# Altium schematic sheet motordriver.SchDoc
size A4; SheetNumber: 4; SheetTotal: 5
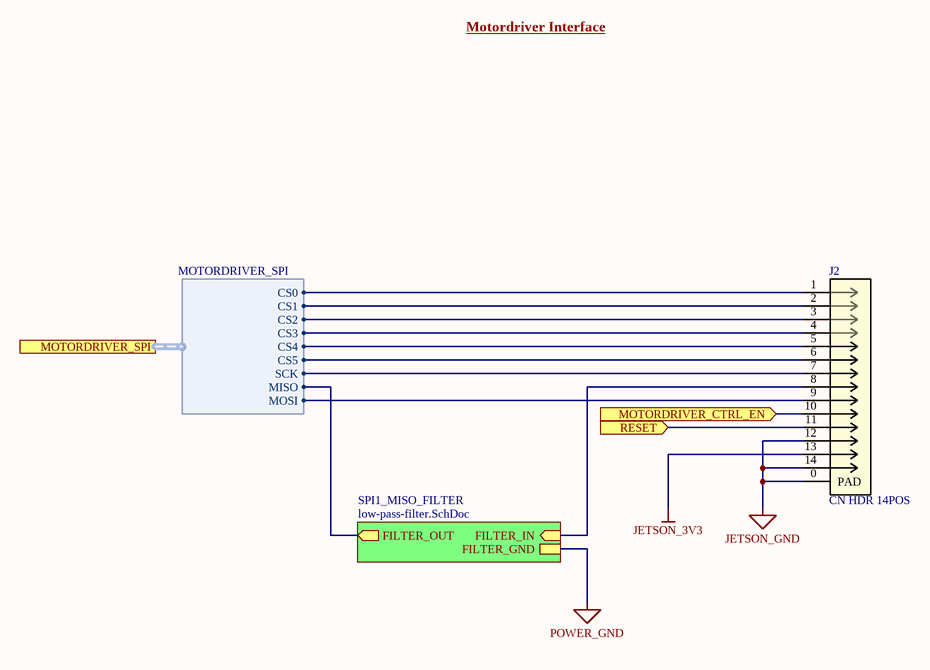
[diagram p0: motordriver.SchDoc]

## Parts
J2  CN HDR 14POS  [CN HDR 14POS SMD 1.5MM]

## Sub-sheets
SPI1_MISO_FILTER = low-pass-filter.SchDoc: FILTER_OUT (out), FILTER_IN (in), FILTER_GND

## Ports
MOTORDRIVER_CTRL_EN (in), MOTORDRIVER_SPI (harness MOTORDRIVER_SPI), RESET (in)

## Harnesses
MOTORDRIVER_SPI: CS0, CS1, CS2, CS3, CS4, CS5, SCK, MISO, MOSI

## Nets
JETSON_3V3: J2.13
JETSON_GND: J2.0(PAD) J2.12 J2.14
POWER_GND: sheet SPI1_MISO_FILTER/FILTER_GND
MOTORDRIVER_CTRL_EN: J2.10 ; port MOTORDRIVER_CTRL_EN
RESET: J2.11 ; port RESET
NetJ2_1: J2.1 ; port MOTORDRIVER_SPI.CS0
NetJ2_2: J2.2 ; port MOTORDRIVER_SPI.CS1
NetJ2_3: J2.3 ; port MOTORDRIVER_SPI.CS2
NetJ2_4: J2.4 ; port MOTORDRIVER_SPI.CS3
NetJ2_5: J2.5 ; port MOTORDRIVER_SPI.CS4
NetJ2_6: J2.6 ; port MOTORDRIVER_SPI.CS5
NetJ2_7: J2.7 ; port MOTORDRIVER_SPI.SCK
NetJ2_8: J2.8 ; sheet SPI1_MISO_FILTER/FILTER_IN
NetJ2_9: J2.9 ; port MOTORDRIVER_SPI.MOSI
(unnamed): sheet SPI1_MISO_FILTER/FILTER_OUT, port MOTORDRIVER_SPI.MISO

## Notes on the sheet
- Motordriver Interface

## Library data of the parts
J2 = CN HDR 14POS: Connector Header 14 Position; Part Number: CN HDR 14POS; Supplier 1: Digi-Key; Supplier Part Number 1: 455-4210-1-ND; Supplier URL 1: https://www.digikey.ca/en/products/detail/jst-sales-america-inc/BM14B-ZESS-TBT-LF-SN/1886998?s=N4IgTCBcDaICwFYEFo5gIwAZnuQOQBEQBdAXyA; Pin Count: 14